# EAGLE design SEMAFORO (EAGLE 7.3.0)
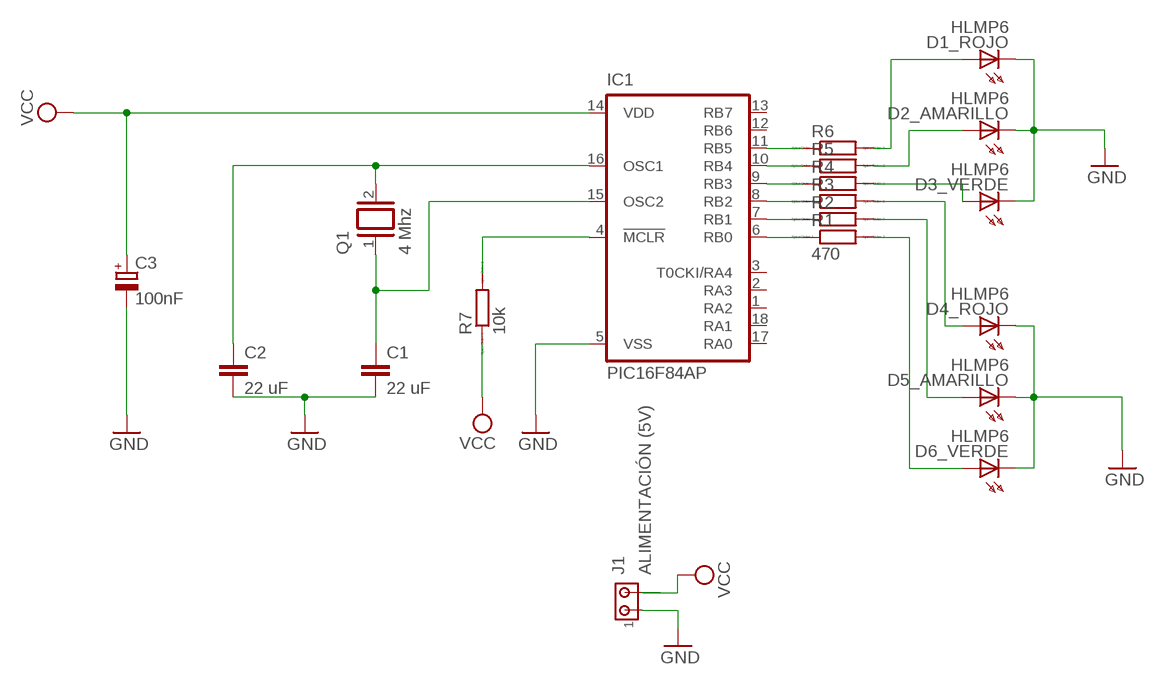
[diagram p0: schematic, sheet 1]

## Parts
C1  22 uF  C2.5/2  [C2.5-2]
C2  22 uF  C2.5/2  [C2.5-2]
C3  100nF  CPOL-EUE1.8-4  [E1,8-4]
D1_ROJO  HLMP6  [HLMP6]
D2_AMARILLO  HLMP6  [HLMP6]
D3_VERDE  HLMP6  [HLMP6]
D4_ROJO  HLMP6  [HLMP6]
D5_AMARILLO  HLMP6  [HLMP6]
D6_VERDE  HLMP6  [HLMP6]
IC1  PIC16F84AP  [DIL18]
J1  ALIMENTACIÓN (5V)  MTA02-100  [10X02MTA]
Q1  4 Mhz  XTAL/S  [QS]
R1  470  R0207/10  [0207/10]
R2  R0207/10  [0207/10]
R3  R0207/10  [0207/10]
R4  R0207/10  [0207/10]
R5  R0207/10  [0207/10]
R6  R0207/10  [0207/10]
R7  10k  R0207/10  [0207/10]

## Nets
GND: C1.2 C2.2 C3.- D1_ROJO.K D2_AMARILLO.K D3_VERDE.K D4_ROJO.K D5_AMARILLO.K D6_VERDE.K IC1.5(VSS) J1.1
N$1: C1.1 IC1.15(OSC2) Q1.1
N$2: C2.1 IC1.16(OSC1) Q1.2
N$3: D2_AMARILLO.A R5.2
N$4: IC1.6(RB0) R1.1
N$5: IC1.7(RB1) R2.1
N$6: IC1.8(RB2) R3.1
N$7: IC1.9(RB3) R4.1
N$8: IC1.10(RB4) R5.1
N$9: IC1.11(RB5) R6.1
N$10: D3_VERDE.A R4.2
N$11: D1_ROJO.A R6.2
N$12: D4_ROJO.A R3.2
N$13: D5_AMARILLO.A R2.2
N$14: D6_VERDE.A R1.2
N$15: IC1.4(!MCLR) R7.2
VCC: C3.+ IC1.14(VDD) J1.2 R7.1
Unconnected: IC1.1(RA2) IC1.2(RA3) IC1.3(T0CKI/RA4) IC1.12(RB6) IC1.13(RB7) IC1.17(RA0) IC1.18(RA1)

## Library data of the parts
C1 C2 = capacitor-wima:C: CAPACITOR naming: grid - package width
C3 = rcl:CPOL-EU: POLARIZED CAPACITOR, European symbol
D1_ROJO D2_AMARILLO D3_VERDE D4_ROJO D5_AMARILLO D6_VERDE = display-hp:HLMP6: LED 2mm horizontal; MF: AGILENT TECHNOLOGIES; MPN: HLMP-6500; OC_FARNELL: 1652490; OC_NEWARK: 40K0088
IC1 = microchip:PIC16F8*: MICROCONTROLLER 8-Bit PIC16F8X Family - CMOS Flash/EEPROM Pin Compatible : PIC16F83, PIC16CR83, PIC16F84A, PIC16CR84 see also PIC16C* <DEVICE:PIC16C*>; MF: MICROCHIP; MPN: PIC16F84A-04I/P; OC_FARNELL: 9760865; OC_NEWARK: 69K7635
J1 = con-amp:MTA02-100: AMP connector
Q1 = special:XTAL/S: CRYSTAL
R1-R7 = eagle-ltspice:R: RESISTOR, European symbol; SPICEMODEL: NONE; SPICEPREFIX: R

## Board
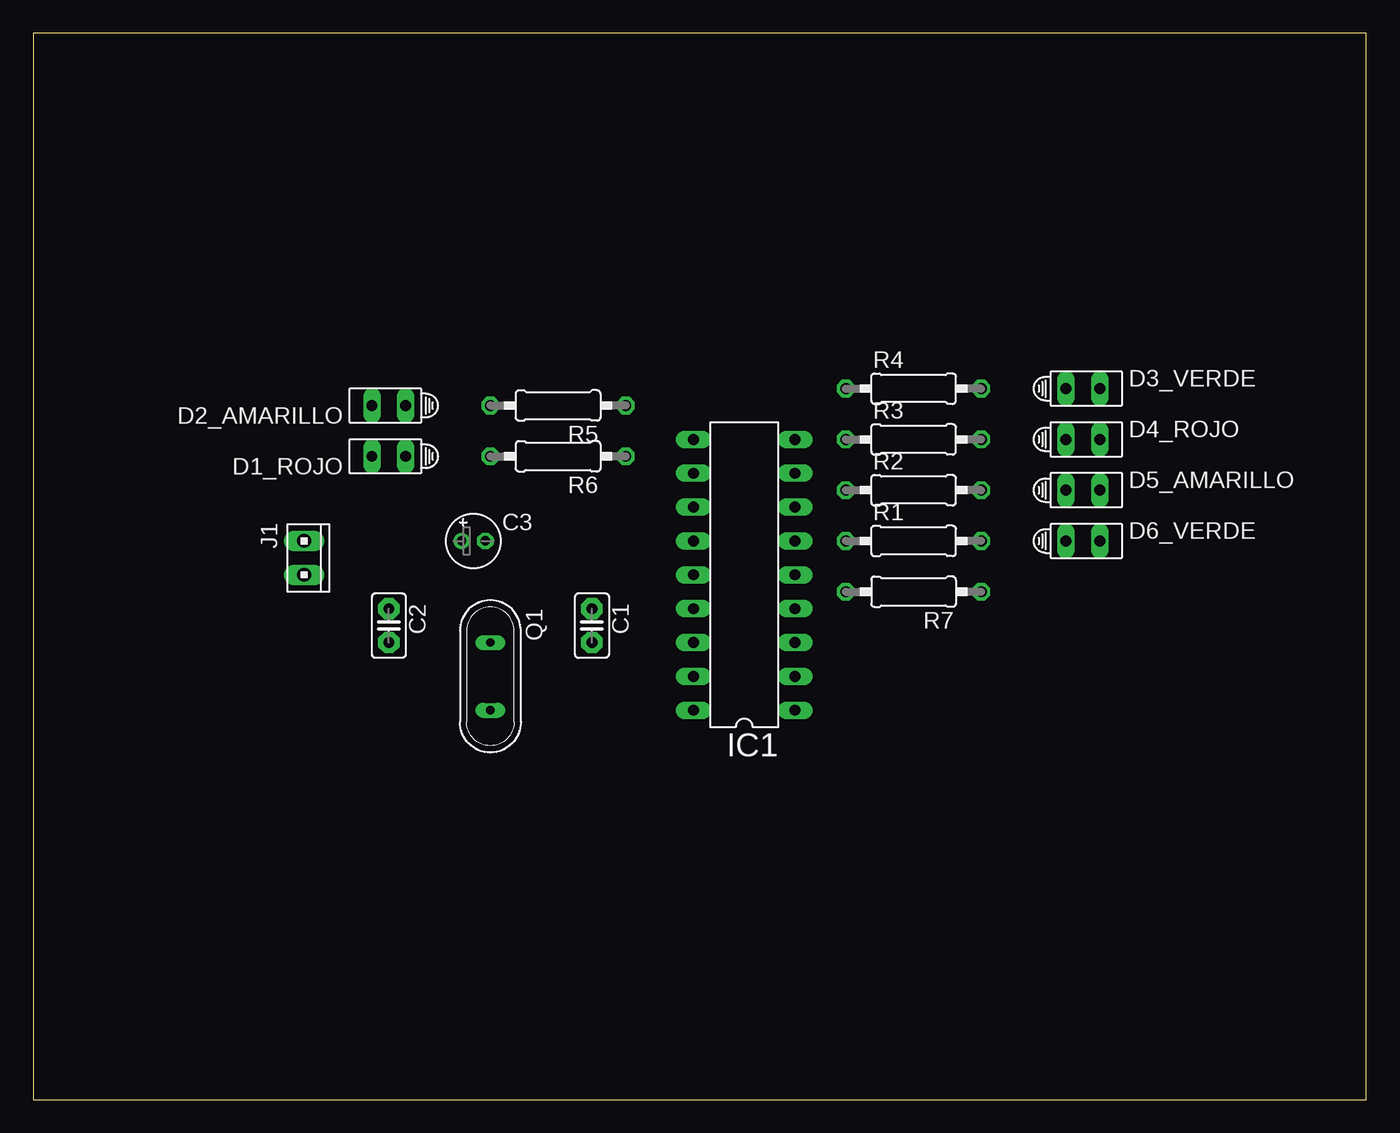
[diagram p1: board, top side]
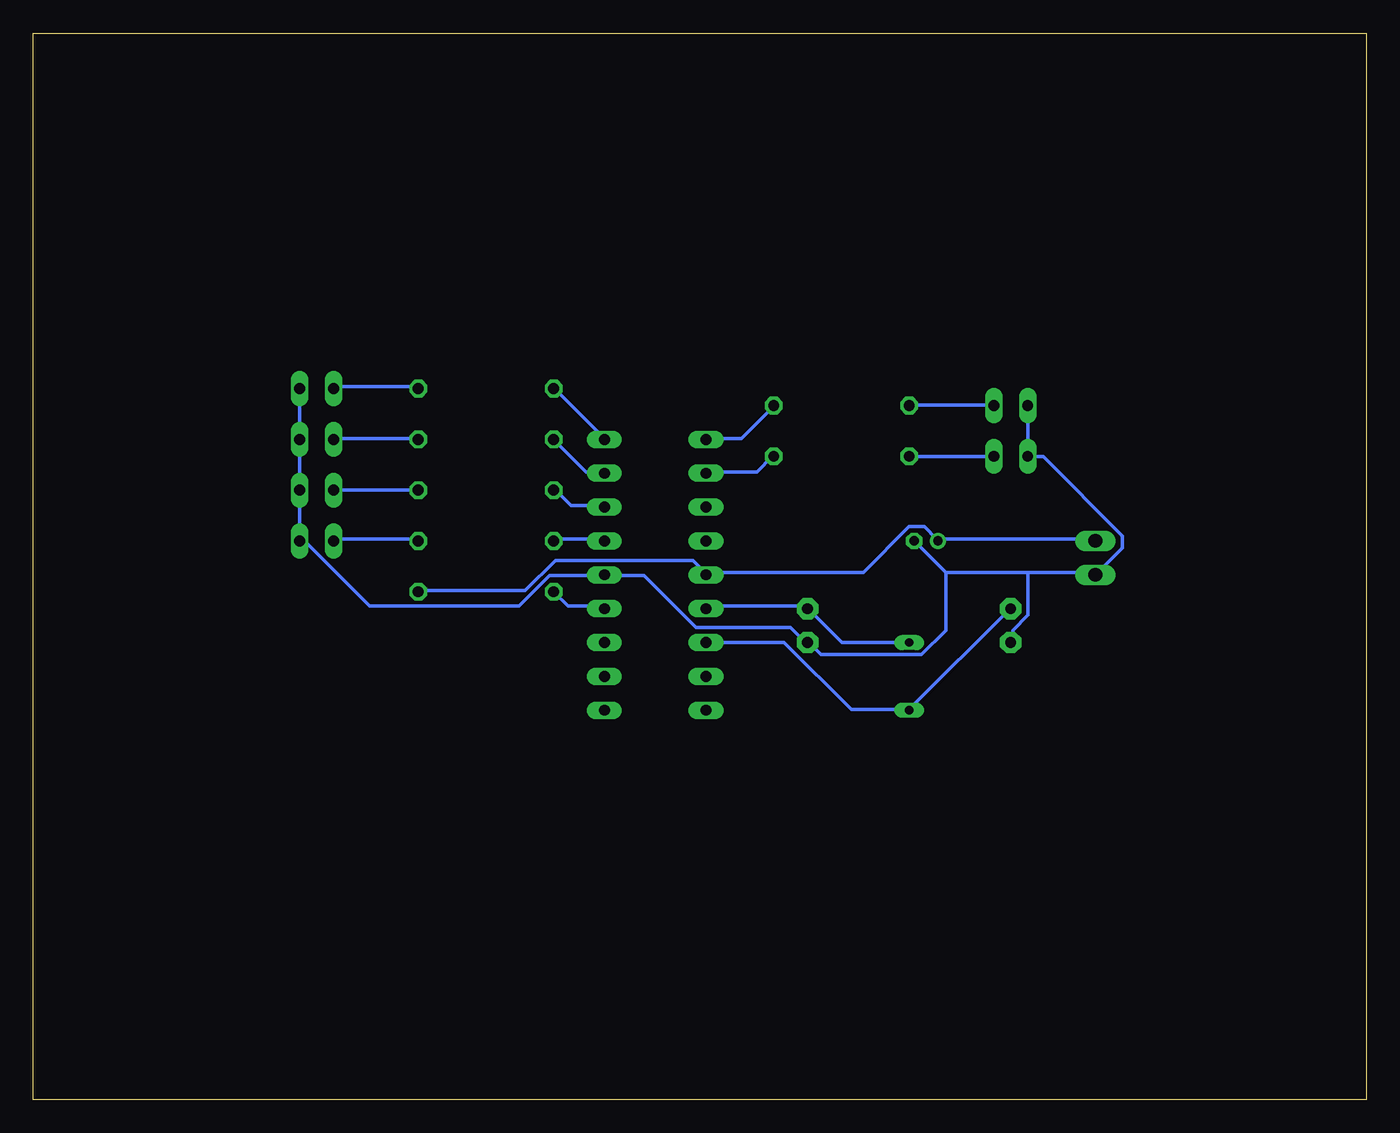
[diagram p2: board, bottom side, seen from below]

Size 100 x 80 mm. Coordinates in mm from the lower left corner, seen from the top.
Outline: 0,0 100,0 100,80 0,80 0,0
Copper layers (1*16): Top 0.035mm / dielectric 1.5mm / Bottom 0.035mm
Design rules "default": minimum track width 10mil, minimum drill 24mil, track to track 8mil, track to pad 8mil, pad to pad 8mil, via to via 8mil, smd to smd 8mil, copper to edge 40mil, drill to drill 8mil, minimum pad ring 10mil, minimum via ring 8mil, stop-mask expansion 4mil, vias tented up to drill 0mil, thermal gap 10mil

### Footprints (pad centres in the part's own frame; a part is rotated, then mirrored left to right if it is on the bottom)
C2.5-2 = drill 0.813 pad 1.6 octagon: 1 -1.27,0; 2 1.27,0
E1,8-4 = drill 0.711 pad 1.168: + -0.889,0 | drill 0.711 pad 1.168 octagon: - 0.889,0
HLMP6 = drill 0.813 long: A -1.27,0; K 1.27,0
DIL18 = drill 0.813 long: 1 -10.16,-3.81; 2 -7.62,-3.81; 3 -5.08,-3.81; 4 -2.54,-3.81; 5 0,-3.81; 6 2.54,-3.81; 7 5.08,-3.81; 8 7.62,-3.81; 9 10.16,-3.81; 10 10.16,3.81; 11 7.62,3.81; 12 5.08,3.81; 13 2.54,3.81; 14 0,3.81; 15 -2.54,3.81; 16 -5.08,3.81; 17 -7.62,3.81; 18 -10.16,3.81
10X02MTA = drill 1.016 long: 1 1.27,0; 2 -1.27,0
QS = drill 0.61 long: 1 -2.54,0; 2 2.54,0
0207/10 = drill 0.813 octagon: 1 -5.08,0; 2 5.08,0

### Placement (x,y rotation side)
C1  41.91,35.56 270 top
C2  26.67,35.56 270 top
C3  33.02,41.91 0 top
D1_ROJO  26.67,48.26 180 top
D2_AMARILLO  26.67,52.07 180 top
D3_VERDE  78.74,53.34 0 top
D4_ROJO  78.74,49.53 0 top
D5_AMARILLO  78.74,45.72 0 top
D6_VERDE  78.74,41.91 0 top
IC1  53.34,39.37 90 top
J1  20.32,40.64 270 top
Q1  34.29,31.75 270 top
R1  66.04,41.91 0 top
R2  66.04,45.72 0 top
R3  66.04,49.53 0 top
R4  66.04,53.34 0 top
R5  39.37,52.07 180 top
R6  39.37,48.26 180 top
R7  66.04,38.1 180 top

### Tracks (layer width: path | path; a pad name or v marks a point on that pad's centre or on a via)
GND
  Bottom 0.254: D2_AMARILLO.K 25.38,51.89 25.38,48.46 D1_ROJO.K 25.38,48.23 24.23,48.23 18.29,42.29 18.29,41.38 20.12,39.55 J1.1 20.34,39.55 25.38,39.55 | 31.55,39.55 C3.- | 25.38,39.55 31.55,39.55 | 25.38,39.55 25.38,36.35 26.52,35.2 26.52,34.29 C2.2 | D3_VERDE.K D4_ROJO.K D5_AMARILLO.K D6_VERDE.K 80.01,41.83 79.55,41.83 74.75,37.03 63.55,37.03 61.27,39.32 57.15,39.32 | 57.15,39.32 54.18,39.32 50.29,35.43 43.2,35.43 42.06,34.29 C1.2 41.83,34.29 40.92,33.38 33.38,33.38 31.55,35.2 31.55,39.55 | 57.15,39.32 IC1.5
N$1
  Bottom 0.254: Q1.1 39.32,34.29 41.83,36.8 C1.1 42.06,37.03 49.38,37.03 IC1.15
N$2
  Bottom 0.254: 34.29,29.26 26.75,36.8 C2.1 | IC1.16 43.66,34.29 38.63,29.26 34.29,29.26 | 34.29,29.26 Q1.2
N$3
  Bottom 0.254: D2_AMARILLO.A 28.12,52.12 34.29,52.12 R5.2
N$4
  Bottom 0.254: IC1.6 57.15,42.06 60.81,42.06 R1.1
N$5
  Bottom 0.254: IC1.7 57.15,44.58 59.66,44.58 60.81,45.72 R2.1
N$6
  Bottom 0.254: R3.1 58.52,47.09 57.15,47.09 IC1.8
N$7
  Bottom 0.254: IC1.9 57.15,49.61 60.81,53.26 R4.1
N$8
  Bottom 0.254: IC1.10 49.38,49.61 46.86,49.61 44.58,51.89 R5.1
N$9
  Bottom 0.254: IC1.11 49.38,47.09 45.72,47.09 44.58,48.23 R6.1
N$10
  Bottom 0.254: R4.2 71.32,53.49 77.27,53.49 D3_VERDE.A
N$11
  Bottom 0.254: D1_ROJO.A 28.12,48.23 34.29,48.23 R6.2
N$12
  Bottom 0.254: R3.2 71.32,49.61 77.27,49.61 D4_ROJO.A
N$13
  Bottom 0.254: D5_AMARILLO.A R2.2
N$14
  Bottom 0.254: R1.2 71.32,42.06 77.27,42.06 D6_VERDE.A
N$15
  Bottom 0.254: R7.2 59.89,37.03 57.15,37.03 IC1.4
VCC
  Bottom 0.254: J1.2 20.34,42.06 32,42.06 C3.+ 32.23,42.06 33.15,42.98 34.29,42.98 37.72,39.55 49.38,39.55 IC1.14 49.61,39.55 50.52,40.46 60.81,40.46 63.09,38.18 71.09,38.18 R7.1